# Altium schematic sheet Schematic.SchDoc
size A
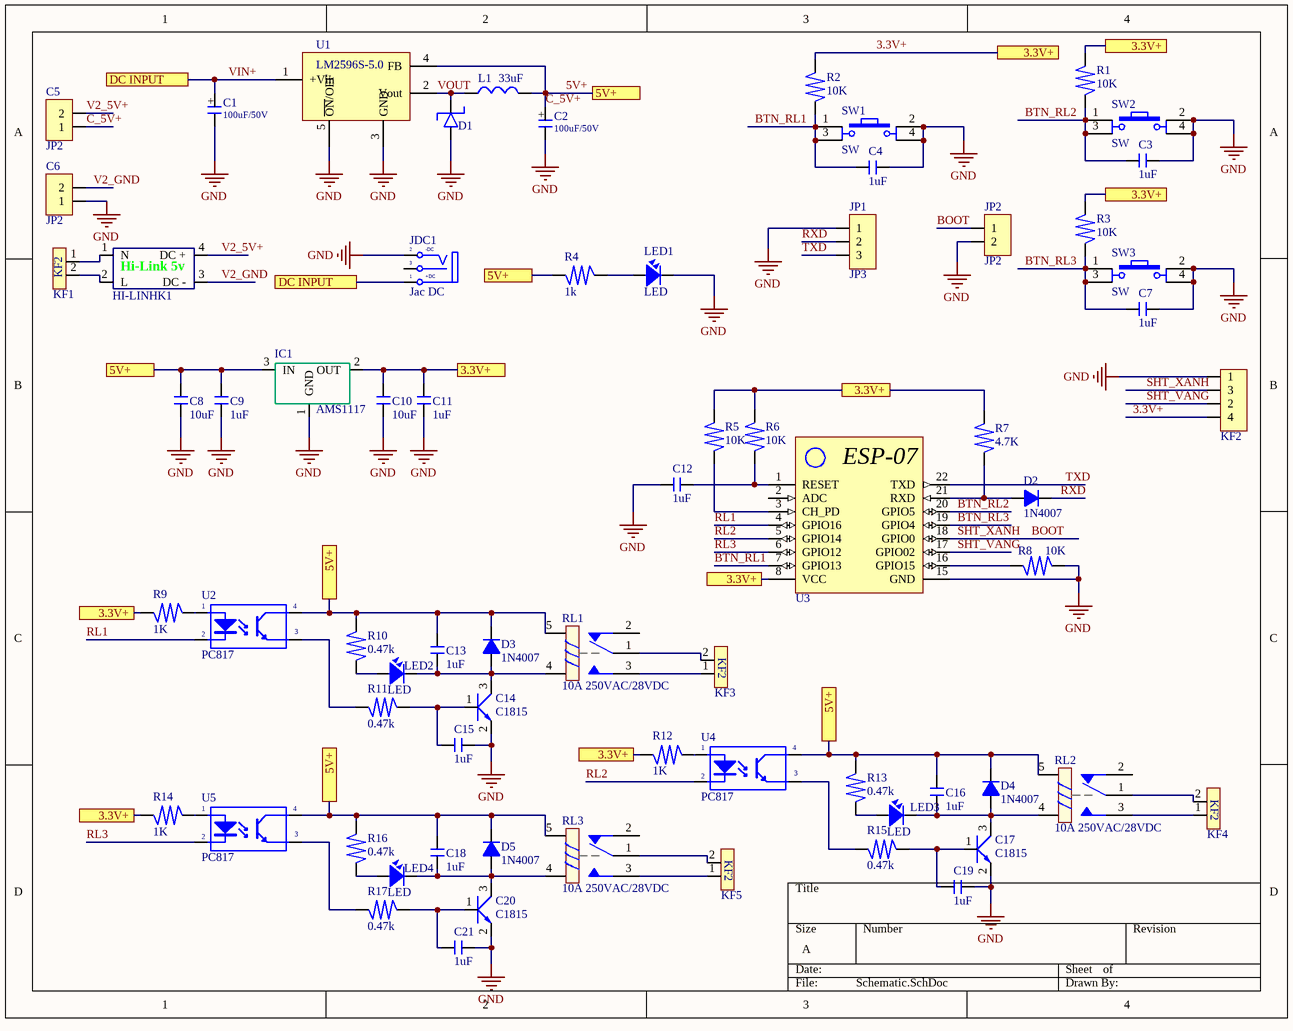
[diagram p0: Schematic.SchDoc]

## Parts
C1  value 100uF/50V  [ALU D8x10]  (hidden comment: CAP ALUM 100UF 50V 20% SMD)
C2  value 100uF/50V  [ALU D8x10]  (hidden comment: CAP ALUM 100UF 50V 20% SMD)
C3  1uF  [C 0603(1608 metric)]
C4  1uF  [C 0603(1608 metric)]
C5  JP2  [JP2-CLOSED]
C6  JP2  [JP2-CLOSED]
C7  1uF  [C 0603(1608 metric)]
C8  10uF  [C 0603(1608 metric)]
C9  1uF  [C 0603(1608 metric)]
C10  10uF  [C 0603(1608 metric)]
C11  1uF  [C 0603(1608 metric)]
C12  1uF  [C 0603(1608 metric)]
C13  1uF  [C 0603(1608 metric)]
C14  C1815  [SOT23]
C15  1uF  [C 0603(1608 metric)]
C16  1uF  [C 0603(1608 metric)]
C17  C1815  [SOT23]
C18  1uF  [C 0603(1608 metric)]
C19  1uF  [C 0603(1608 metric)]
C20  C1815  [SOT23]
C21  1uF  [C 0603(1608 metric)]
D1  SS34 SMA  [SS34-SMA]  (value not drawn)
D2  1N4007  [SMA]
D3  1N4007  [SMA]
D4  1N4007  [SMA]
D5  1N4007  [SMA]
HI-LINHK1  Hi-link 5v  [Hi-Link]  (value not drawn)
IC1  AMS1117  [AMS-1117]
JDC1  Jac DC  [DC-IN]
JP1  JP3  [JP3-D1T]
JP2  JP2  [JP2-CLOSED]
KF1  Terminal Block 2Pin 5.08  KF2EDGK-5.08-2P-L  [KF2-7.62]  (value not drawn)
KF2  Terminal Block 4Pin 5.08  KF4EDGK-5.08-24-L  [HED4T]  (value not drawn)
KF3  Terminal Block 2Pin 5.08  KF2EDGK-5.08-2P-L  [KF2-7.62]  (value not drawn)
KF4  Terminal Block 2Pin 5.08  KF2EDGK-5.08-2P-L  [KF2-7.62]  (value not drawn)
KF5  Terminal Block 2Pin 5.08  KF2EDGK-5.08-2P-L  [KF2-7.62]  (value not drawn)
L1  33uF  [RH127-471]
LED1  LED  [LED-3]
LED2  LED  [LED-3]
LED3  LED  [LED-3]
LED4  LED  [LED-3]
R1  value 10K  [RES_0603]  (hidden comment: RES 0.3K Ohm 0805 5%)
R2  value 10K  [RES_0603]  (hidden comment: RES 0.3K Ohm 0805 5%)
R3  value 10K  [RES_0603]  (hidden comment: RES 0.3K Ohm 0805 5%)
R4  value 1k  [RES_0603]  (hidden comment: RES 0.3K Ohm 0805 5%)
R5  value 10K  [RES_0603]  (hidden comment: RES 0.3K Ohm 0805 5%)
R6  value 10K  [RES_0603]  (hidden comment: RES 0.3K Ohm 0805 5%)
R7  value 4.7K  [RES_0603]  (hidden comment: RES 0.3K Ohm 0805 5%)
R8  value 10K  [RES_0603]  (hidden comment: RES 0.3K Ohm 0805 5%)
R9  value 1K  [RES_0603]  (hidden comment: RES 0.3K Ohm 0805 5%)
R10  value 0.47k  [RES_0603]  (hidden comment: RES 0.3K Ohm 0805 5%)
R11  value 0.47k  [RES_0603]  (hidden comment: RES 0.3K Ohm 0805 5%)
R12  value 1K  [RES_0603]  (hidden comment: RES 0.3K Ohm 0805 5%)
R13  value 0.47k  [RES_0603]  (hidden comment: RES 0.3K Ohm 0805 5%)
R14  value 1K  [RES_0603]  (hidden comment: RES 0.3K Ohm 0805 5%)
R15  value 0.47k  [RES_0603]  (hidden comment: RES 0.3K Ohm 0805 5%)
R16  value 0.47k  [RES_0603]  (hidden comment: RES 0.3K Ohm 0805 5%)
R17  value 0.47k  [RES_0603]  (hidden comment: RES 0.3K Ohm 0805 5%)
RL1  10A 250VAC/28VDC  [RL_SRD-5VDC]
RL2  10A 250VAC/28VDC  [RL_SRD-5VDC]
RL3  10A 250VAC/28VDC  [RL_SRD-5VDC]
SW1  SW  [SW4]
SW2  SW  [SW4]
SW3  SW  [SW4]
U1  IC REG BUCK 5V 3A TO263-5*  [TO263-5 - duplicate]  (value not drawn)
U2  PC817  [PC817_DIP]
U3  ISM 2.4Ghz, 802.11 b/g/n, PA: +25dBm  [Esp-07]  (value not drawn)
U4  PC817  [PC817_DIP]
U5  PC817  [PC817_DIP]

## Ports
3.3V+, 5V+, DC INPUT

## Nets
GND: C1.2(+) C2.2(+) C3.2 C4.2 C6.1 C7.2 C8.1 C9.1 C10.1 C11.1 C12.1 C14.2(E) C15.1 C17.2(E) C19.1 C20.2(E) C21.1 D1.1 IC1.1(GND) JDC1.2(TN) JP1.1 JP2.2 KF2.1 LED1.2 R8.2 SW1.2 SW1.4 SW2.2 SW2.4 SW3.2 SW3.4 U1.3(GND) U1.5(~{ON}/OFF) U3.15(GND)
3.3V+: C10.2 C11.2 IC1.2(OUT) KF2.4 R1.2 R2.2 R3.2 R5.2 R6.2 R7.2 R9.1 R12.1 R14.1 U3.8(VCC) ; port 3.3V+
5V+: C2.1(+) C5.1 C8.2 C9.2 C13.2 C16.2 C18.2 D3.2(K) D4.2(K) D5.2(K) IC1.3(IN) L1.2 R4.1 R10.2 R13.2 R16.2 RL1.5 RL2.5 RL3.5 U1.4(FB) U2.4(C) U4.4(C) U5.4(C) ; port 5V+  [also labelled C_5V+]
BOOT: JP2.1 KF2.3 U3.18(GPIO0)  [also labelled SHT_XANH]
BTN_RL1: C4.1 R2.1 SW1.1 SW1.3 U3.7(GPIO13)
BTN_RL2: C3.1 R1.1 SW2.1 SW2.3 U3.20(GPIO5)
BTN_RL3: C7.1 R3.1 SW3.1 SW3.3 U3.19(GPIO4)
RL1: U2.2(K) U3.4(GPIO16)
RL2: U3.5(GPIO14) U4.2(K)
RL3: U3.6(GPIO12) U5.2(K)
RXD: D2.2(K) JP1.2
SHT_VANG: KF2.2 U3.17(GPIO02)
TXD: JP1.3 U3.22(TXD)
V2_5V+: C5.2 HI-LINHK1.4(DC_+)
V2_GND: C6.2 HI-LINHK1.3(DC_-)
VIN+: C1.1(+) JDC1.1(T) U1.1(+Vin) ; port DC INPUT
VOUT: D1.2 L1.1 U1.2(Vout)
NetC12_2: C12.2 R6.1 U3.1(RESET)
NetC13_1: C13.1 C14.3(C) D3.1(A) LED2.2 RL1.4
NetC14_1: C14.1(B) C15.2 R11.1
NetC16_1: C16.1 C17.3(C) D4.1(A) LED3.2 RL2.4
NetC17_1: C17.1(B) C19.2 R15.1
NetC18_1: C18.1 C20.3(C) D5.1(A) LED4.2 RL3.4
NetC20_1: C20.1(B) C21.2 R17.1
NetD2_1: D2.1(A) R7.1 U3.21(RXD)
NetHI-LINHK1_1: HI-LINHK1.1(N) KF1.1
NetHI-LINHK1_2: HI-LINHK1.2(L) KF1.2
NetKF3_1: KF3.1 RL1.3
NetKF3_2: KF3.2 RL1.1
NetKF4_1: KF4.1 RL2.3
NetKF4_2: KF4.2 RL2.1
NetKF5_1: KF5.1 RL3.3
NetKF5_2: KF5.2 RL3.1
NetLED1_1: LED1.1 R4.2
NetLED2_1: LED2.1 R10.1
NetLED3_1: LED3.1 R13.1
NetLED4_1: LED4.1 R16.1
NetR5_1: R5.1 U3.3(CH_PD)
NetR8_1: R8.1 U3.16(GPIO15)
NetR9_2: R9.2 U2.1(A)
NetR11_2: R11.2 U2.3(E)
NetR12_2: R12.2 U4.1(A)
NetR14_2: R14.2 U5.1(A)
NetR15_2: R15.2 U4.3(E)
NetR17_2: R17.2 U5.3(E)

Not connected (* = marked no-connect by the designer): JDC1 3(S); RL1 2; RL2 2; RL3 2; U3 2(ADC)

## Notes on the sheet
- (in symbol DCIN) -DC; +DC
- (in symbol ESP-7 ESP8266) ESP-07
- (in symbol Hi-link 5v) Hi-Link 5v

## Library data of the parts
C1 C2 = Alu 100uF/50v: 100UF 50V, 20%, Size D=8mm, L=10mm; Supplier 1: Arrow; Supplier Part Number 1: EEV-HA1H101P
C3 C4 C7-C13 C15 C16 C18 C19 C21 = CAP 0603 SMD: Capacitors Size SMD 0603
C5 C6 JP2 = JP2: WR-PHD 2.54 mm Angled Socket Header; Manufacturer: W¨¹rth Elektronik eiSos GmbH; partNo: 613002143121; ComponentLink1 Description: Manufacturer; ComponentLink2 Description: Datasheet; NoPins: 02; Created Date: 29 March 2013; ComponentLink1URL: http://www.we-online.com; ComponentLink2URL: http://katalog.we-online.de/em/datasheet/6130xx143121.pdf; Created by: Karrer Zheng
C14 C17 C20 = C1815 2SC1815-HF: NPN ECB transistor, SOT23-3 package; Supplier 1: Digi-Key
D1 = SS34 SMA: Size A, DIODE SCHOTTKY 3A 40V SMA; Supplier 1: Newark; Supplier Part Number 1: 90R9194
D2-D5 = diode: Diode 1A; Value: 1N4007
IC1 = AMS1117 3.3V
JDC1 = DCIN: Jac DC input; Value: Jac DC
JP1 = JP3: WR-PHD 2.54 mm Angled Socket Header; Manufacturer: W¨¹rth Elektronik eiSos GmbH; partNo: 613003143121; ComponentLink1 Description: Manufacturer; ComponentLink2 Description: Datasheet; NoPins: 03; Created Date: 29 March 2013; ComponentLink1URL: http://www.we-online.com; ComponentLink2URL: http://katalog.we-online.de/em/datasheet/6130xx143121.pdf; Created by: Karrer Zheng
KF1 KF3-KF5 = KF2: KF2 7.62
KF2 = KF4(KF4EDGK-5.08-4P-L)_1
L1 = L 33UH RH127: 33UH (330) 3A, Size 12x12x7mm
LED1-LED4 = LED-DIP: LED Single colour Green and Red; Value: LED 3 ly Single Colour
R1-R17 = R-0603-1k 5%: SMD Resistor 3k OHM (Code 103) 1/8W 5% 0805 SMD; Supplier 1: Digi-Key; Supplier Part Number 1: 311-330ATR-ND
RL1-RL3 = Relay SRD-5VDC-SL-C: 5V DC SONGLE Power Relay SRD-05VDC-SL-C  (5 Pin mit NC / NO); Value: Relay SPDT, 10A, 12V
SW1-SW3 = SW4: Switch button 4 pin; Value: Button chip 4 pin
U1 = LM2596S-5.0: Buck Switching Regulator IC Positive Fixed 5V 1 Output 3A TO-263-6, D²Pak (5 Leads + Tab), TO-263BA; Supplier 1: Digi-Key; Supplier Part Number 1: LM2599S-5.0-ND
U2 U4 U5 = PC817: Single Opto; Value: PC817
U3 = ESP-7 ESP8266